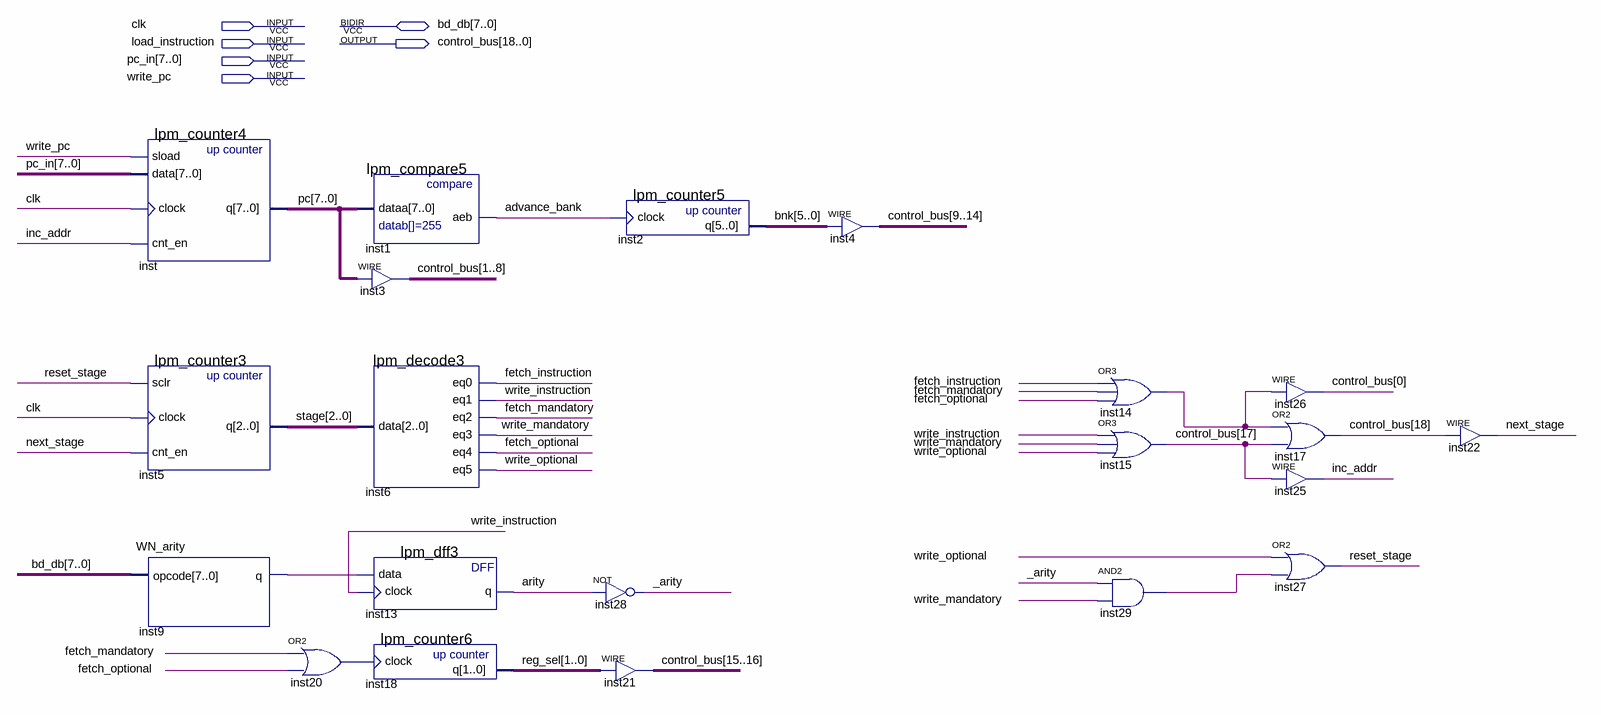
[diagram p0: schematic sheet]
// Quartus schematic WN_opcode_loader_GPR.bdf as structural Verilog: 21 symbols, 6 pins
module WN_opcode_loader_GPR (
  input  clk,
  input  load_instruction,
  input  [7:0] pc_in,
  input  write_pc,
  inout  [7:0] bd_db,
  output [18:0] control_bus
);

  wire _arity, advance_bank, arity, fetch_instruction, fetch_mandatory, fetch_optional, inc_addr, inst9_q,
       inst14_out, inst20_out, inst29_out, next_stage, reset_stage, write_instruction, write_mandatory,
       write_optional;
  wire [1:0] reg_sel;
  wire [2:0] stage;
  wire [5:0] bnk;
  wire [7:0] pc;

  lpm_counter4 inst (.sload(write_pc), .data(pc_in), .clock(clk), .cnt_en(inc_addr), .q(pc));
  lpm_counter3 inst5 (.sclr(reset_stage), .clock(clk), .cnt_en(next_stage), .q(stage));
  WN_arity inst9 (.opcode(bd_db), .q(inst9_q));
  or inst20 (inst20_out, fetch_mandatory, fetch_optional);
  lpm_compare5 inst1 (.dataa(pc), .aeb(advance_bank));
  assign {control_bus[1], control_bus[2], control_bus[3], control_bus[4], control_bus[5], control_bus[6], control_bus[7], control_bus[8]} = pc;  // WIRE inst3
  lpm_decode3 inst6 (
    .data(stage), .eq0(fetch_instruction), .eq1(write_instruction), .eq2(fetch_mandatory),
    .eq3(write_mandatory), .eq4(fetch_optional), .eq5(write_optional));
  lpm_dff3 inst13 (.data(inst9_q), .clock(write_instruction), .q(arity));
  lpm_counter6 inst18 (.clock(inst20_out), .q(reg_sel));
  not inst28 (_arity, arity);
  lpm_counter5 inst2 (.clock(advance_bank), .q(bnk));
  assign {control_bus[15], control_bus[16]} = reg_sel;  // WIRE inst21
  assign {control_bus[9], control_bus[10], control_bus[11], control_bus[12], control_bus[13], control_bus[14]} = bnk;  // WIRE inst4
  or inst14 (inst14_out, fetch_instruction, fetch_mandatory, fetch_optional);
  or inst15 (control_bus[17], write_instruction, write_mandatory, write_optional);
  and inst29 (inst29_out, _arity, write_mandatory);
  assign control_bus[0] = inst14_out;  // WIRE inst26
  or inst17 (control_bus[18], inst14_out, control_bus[17]);
  assign inc_addr = control_bus[17];  // WIRE inst25
  or inst27 (reset_stage, write_optional, inst29_out);
  assign next_stage = control_bus[18];  // WIRE inst22
endmodule
